# EAGLE design combined-board (EAGLE 7.2.0)
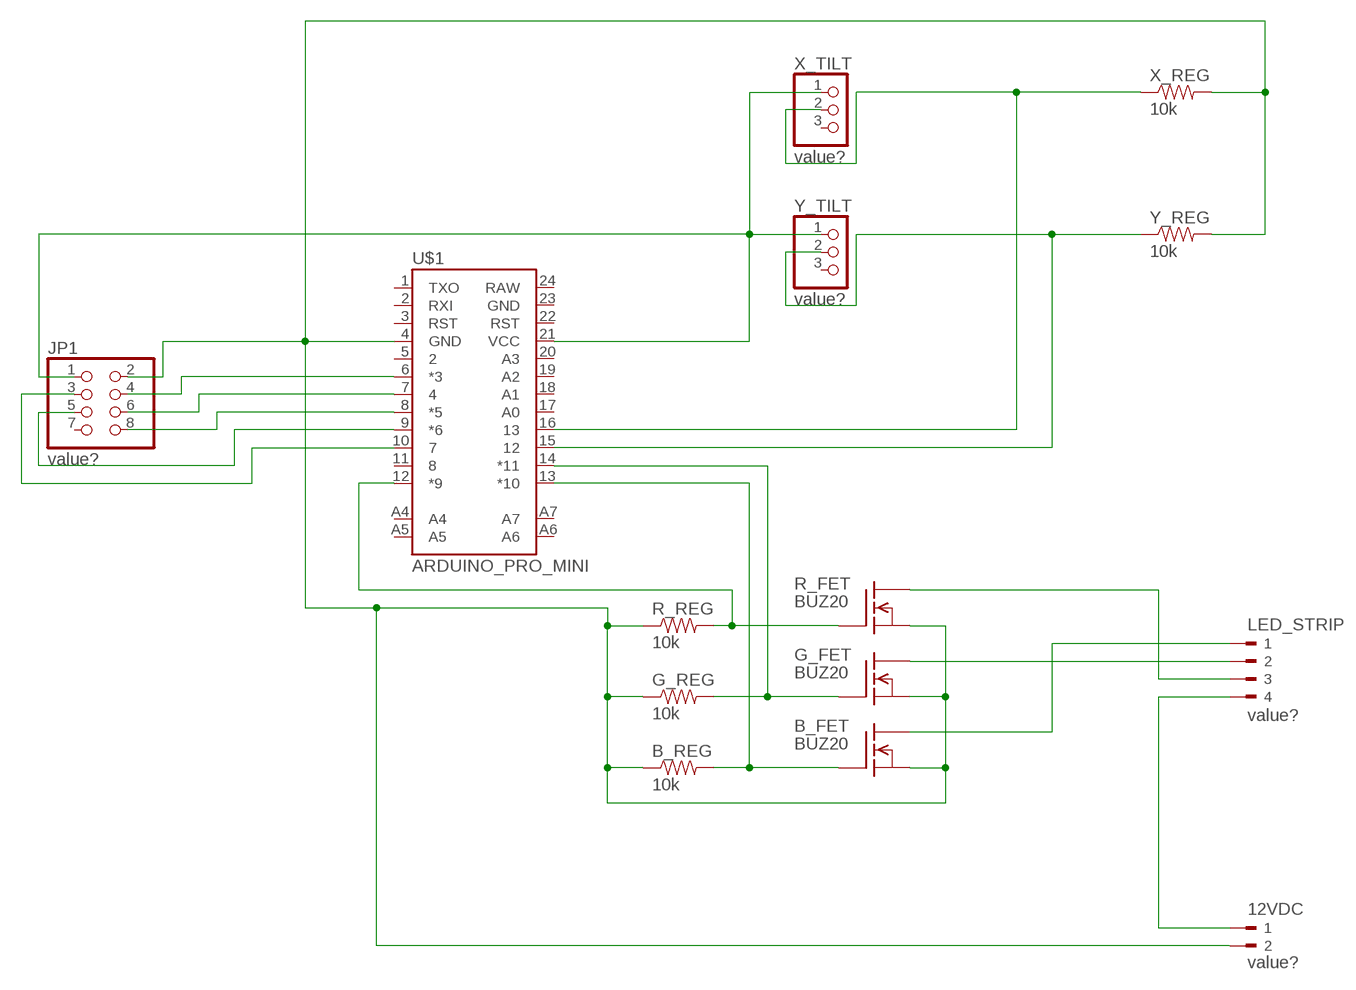
[diagram p0: schematic, sheet 1]

## Parts
12VDC  value?  180-2  [180-2]
B_FET  BUZ20  [TO220]
B_REG  10k  RESISTORPTH-1/4W  [AXIAL-0.4]
G_FET  BUZ20  [TO220]
G_REG  10k  RESISTORPTH-1/4W  [AXIAL-0.4]
JP1  value?  PINHD-2X4  [2X04]
LED_STRIP  value?  180-4  [180-4]
R_FET  BUZ20  [TO220]
R_REG  10k  RESISTORPTH-1/4W  [AXIAL-0.4]
U$1  ARDUINO_PRO_MINI  [ARDUINO_PRO_MINI]
X_REG  10k  RESISTORPTH-1/4W  [AXIAL-0.4]
X_TILT  value?  PINHD-1X3  [1X03]
Y_REG  10k  RESISTORPTH-1/4W  [AXIAL-0.4]
Y_TILT  value?  PINHD-1X3  [1X03]

## Nets
N$1: U$1.16 X_REG.P$1 X_TILT.2
N$2: B_FET.1(G) B_REG.P$2 U$1.13(*10)
N$3: R_FET.1(G) R_REG.P$2 U$1.12(*9)
N$5: B_FET.2(D) LED_STRIP.1
N$6: U$1.15 Y_REG.P$1 Y_TILT.2
N$7: LED_STRIP.3 R_FET.2(D)
N$8: G_FET.2(D) LED_STRIP.2
N$9: 12VDC.1 LED_STRIP.4
N$10: 12VDC.2 B_FET.3(S) B_REG.P$1 G_FET.3(S) G_REG.P$1 JP1.2 R_FET.3(S) R_REG.P$1 U$1.4(GND) X_REG.P$2 Y_REG.P$2
N$12: JP1.5 U$1.9(*6)
N$13: G_FET.1(G) G_REG.P$2 U$1.14(*11)
N$14: JP1.4 U$1.6(*3)
N$15: JP1.6 U$1.7
N$16: JP1.8 U$1.8(*5)
N$17: JP1.3 U$1.10
Y_TILT: JP1.1 U$1.21(VCC) X_TILT.1 Y_TILT.1
Unconnected: JP1.7 U$1.1(TXO) U$1.2(RXI) U$1.3(RST) U$1.5 U$1.11 U$1.17(A0) U$1.18(A1) U$1.19(A2) U$1.20(A3) U$1.22(RST) U$1.23(GND) U$1.24(RAW) U$1.A4 U$1.A5 U$1.A6 U$1.A7 X_TILT.3 Y_TILT.3

## Library data of the parts
12VDC = con-weidmueller-sl35:180-2: WEIDMUELLER CLAMP CONNECTOR; OC_FARNELL: unknown; OC_NEWARK: unknown
B_FET G_FET R_FET = transistor-fet:BUZ20: N-Channel Enhancement MOSFET 100V; 12A; 0,2Ohm
B_REG G_REG R_REG X_REG Y_REG = SparkFun-Passives:RESISTOR: Resistor Basic schematic elements and footprints for 0603, 1206, and PTH resistors.
JP1 = pinhead:PINHD-2X4: PIN HEADER
LED_STRIP = con-weidmueller-sl35:180-4: WEIDMUELLER CLAMP CONNECTOR; OC_FARNELL: unknown; OC_NEWARK: unknown
U$1 = SparkFun-Boards:ARDUINO_PRO_MINI
X_TILT Y_TILT = pinhead:PINHD-1X3: PIN HEADER

## Board
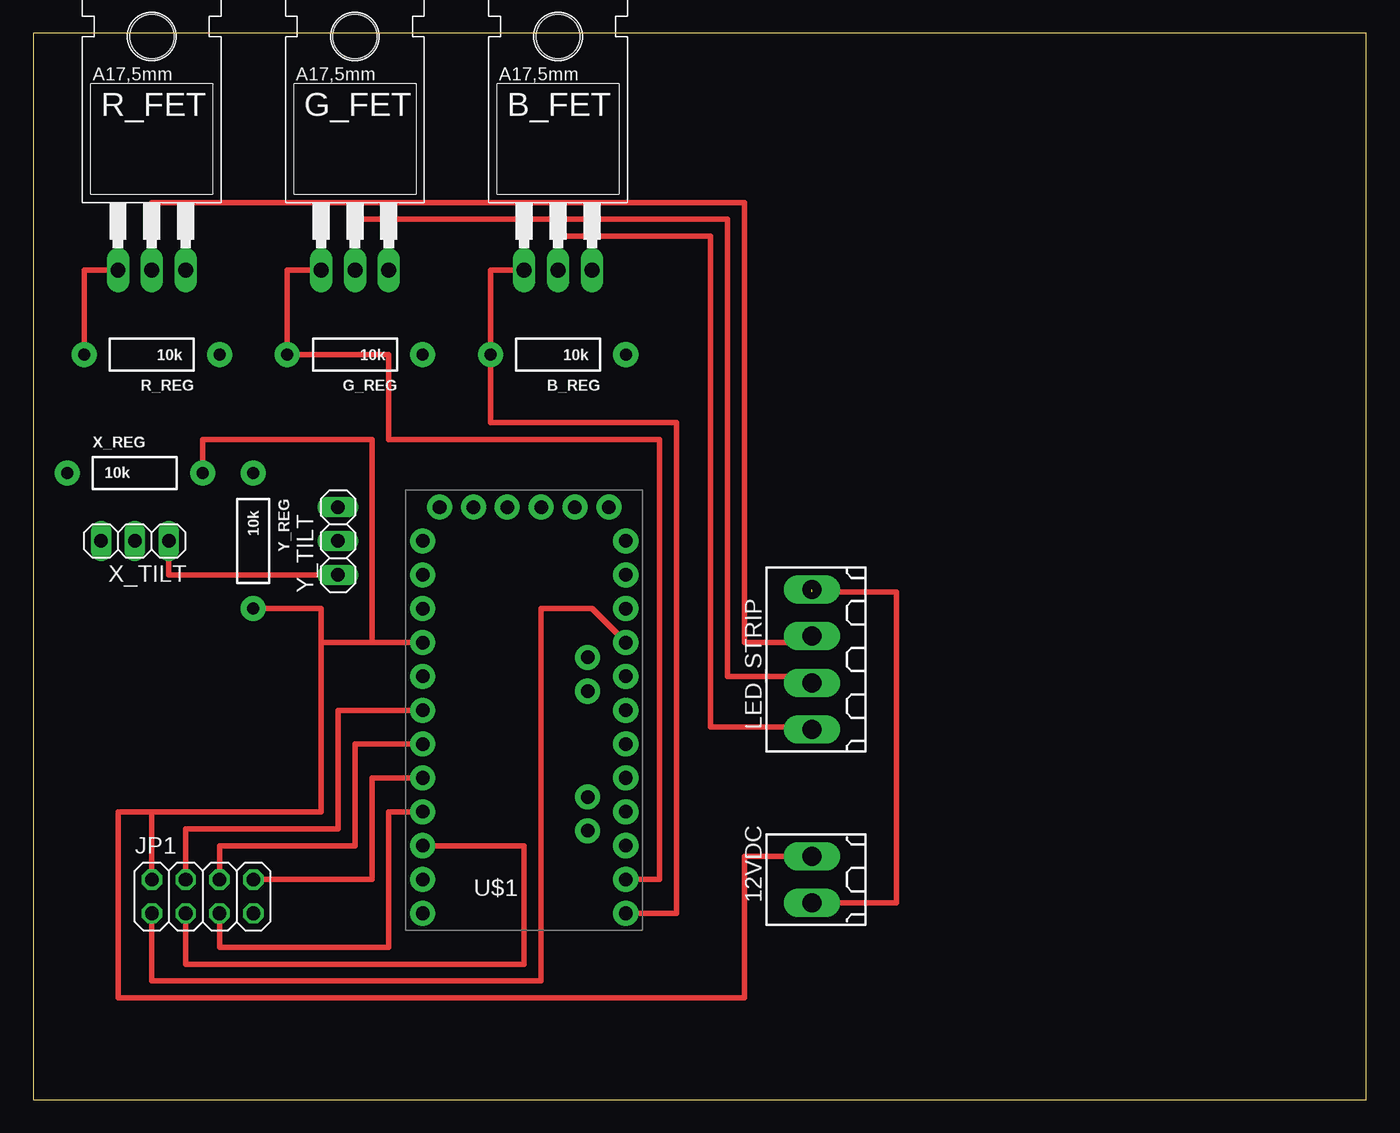
[diagram p1: board, top side]
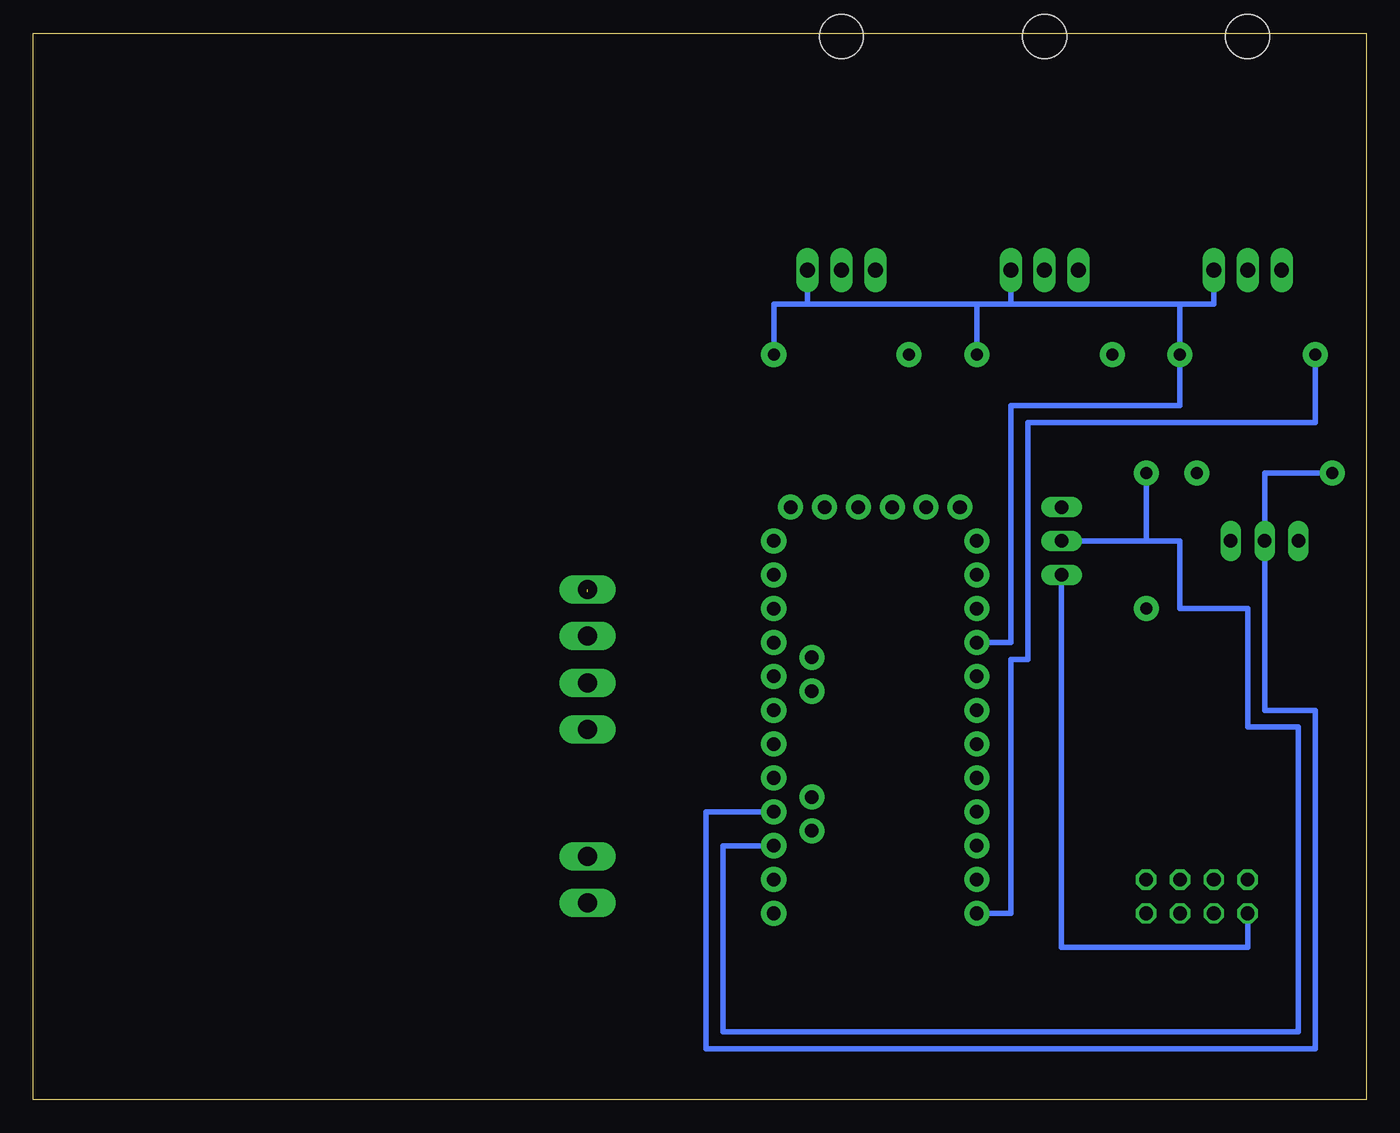
[diagram p2: board, bottom side, seen from below]

Size 100 x 80 mm. Coordinates in mm from the lower left corner, seen from the top.
Outline: 0,0 100,0 100,80 0,80 0,0
Copper layers (1*16): Top 0.035mm / dielectric 1.5mm / Bottom 0.035mm
Design rules "default": minimum track width 10mil, minimum drill 24mil, track to track 8mil, track to pad 8mil, pad to pad 8mil, via to via 8mil, smd to smd 8mil, copper to edge 40mil, drill to drill 8mil, minimum pad ring 10mil, minimum via ring 8mil, stop-mask expansion 4mil, vias tented up to drill 0mil, thermal gap 10mil

### Footprints (pad centres in the part's own frame; a part is rotated, then mirrored left to right if it is on the bottom)
180-2 = drill 1.422 long: 1 -1.75,0; 2 1.75,0
TO220 = drill 1.118 long: 1 -2.54,-6.35; 2 0,-6.35; 3 2.54,-6.35 | hole 3.302: 0,11.176
AXIAL-0.4 = drill 0.9 pad 1.88: P$1 -5.08,0; P$2 5.08,0
2X04 = drill 1.016 octagon: 1 -3.81,-1.27; 2 -3.81,1.27; 3 -1.27,-1.27; 4 -1.27,1.27; 5 1.27,-1.27; 6 1.27,1.27; 7 3.81,-1.27; 8 3.81,1.27
180-4 = drill 1.422 long: 1 -5.25,0; 2 -1.75,0; 3 1.75,0; 4 5.25,0
ARDUINO_PRO_MINI = drill 1.016 pad 1.88: 1 -7.62,12.7; 2 -7.62,10.16; 3 -7.62,7.62; 4 -7.62,5.08; 5 -7.62,2.54; 6 -7.62,0; 7 -7.62,-2.54; 8 -7.62,-5.08; 9 -7.62,-7.62; 10 -7.62,-10.16; 11 -7.62,-12.7; 12 -7.62,-15.24; 13 7.62,-15.24; 14 7.62,-12.7; 15 7.62,-10.16; 16 7.62,-7.62; 17 7.62,-5.08; 18 7.62,-2.54; 19 7.62,0; 20 7.62,2.54; 21 7.62,5.08; 22 7.62,7.62; 23 7.62,10.16; 24 7.62,12.7; A4 4.763,1.429; A5 4.763,3.969; A6 4.763,-9.049; A7 4.763,-6.509; BLK -6.35,15.24; GND -3.81,15.24; GRN 6.35,15.24; RXI 1.27,15.24; TXO 3.81,15.24; VCC -1.27,15.24
1X03 = drill 1.016 long: 1 -2.54,0; 2 0,0; 3 2.54,0

### Placement (x,y rotation side)
12VDC  58.42,16.51 90 top
B_FET  39.37,68.58 0 top
B_REG  39.37,55.88 180 top
G_FET  24.13,68.58 0 top
G_REG  24.13,55.88 180 top
JP1  12.7,15.24 0 top
LED_STRIP  58.42,33.02 90 top
R_FET  8.89,68.58 0 top
R_REG  8.89,55.88 180 top
U$1  36.83,29.21 0 top
X_REG  7.62,46.99 0 top
X_TILT  7.62,41.91 180 top
Y_REG  16.51,41.91 270 top
Y_TILT  22.86,41.91 90 top

### Tracks (layer width: path | path; a pad name or v marks a point on that pad's centre or on a via)
N$1
  Bottom 0.406: U$1.16 49.53,21.59 49.53,3.81 3.81,3.81 3.81,29.21 7.62,29.21 X_TILT.2 7.62,46.99 X_REG.P$1
N$2
  Top 0.406: B_FET.1 34.29,62.23 B_REG.P$2 34.29,50.8 48.26,50.8 48.26,13.97 U$1.13
N$3
  Top 0.406: R_FET.1 3.81,62.23 R_REG.P$2
  Bottom 0.406: R_REG.P$2 3.81,50.8 25.4,50.8 25.4,33.02 26.67,33.02 26.67,13.97 U$1.12
N$5
  Top 0.406: B_FET.2 39.37,64.77 50.8,64.77 50.8,27.94 58.42,27.94 LED_STRIP.1
N$6
  Bottom 0.406: U$1.15 48.26,19.05 48.26,5.08 5.08,5.08 5.08,27.94 8.89,27.94 8.89,36.83 13.97,36.83 13.97,41.91 16.51,41.91 | 16.51,41.91 Y_TILT.2 | Y_REG.P$1 16.51,41.91
N$7
  Top 0.406: R_FET.2 8.89,67.31 53.34,67.31 53.34,34.29 58.42,34.29 LED_STRIP.3
N$8
  Top 0.406: G_FET.2 24.13,66.04 52.07,66.04 52.07,31.75 58.42,31.75 LED_STRIP.2
N$9  (1 unrouted)
  Top 0.406: 12VDC.1 64.77,14.76 64.77,38.1 58.42,38.1
N$10
  Top 0.406: JP1.2 8.89,21.59 | 8.89,21.59 21.59,21.59 21.59,34.29 | 21.59,34.29 25.4,34.29 | 25.4,34.29 U$1.4 | 12VDC.2 53.34,18.26 53.34,7.62 6.35,7.62 6.35,21.59 8.89,21.59 | Y_REG.P$2 21.59,36.83 21.59,34.29 | X_REG.P$2 12.7,49.53 25.4,49.53 25.4,34.29
  Bottom 0.406: 13.97,59.69 26.67,59.69 | 26.67,59.69 29.21,59.69 | B_FET.3 41.91,59.69 | G_REG.P$1 29.21,59.69 | 29.21,59.69 41.91,59.69 | 13.97,59.69 R_REG.P$1 13.97,52.07 26.67,52.07 26.67,34.29 U$1.4 | 13.97,59.69 11.43,59.69 R_FET.3 | B_REG.P$1 44.45,59.69 41.91,59.69 | G_FET.3 26.67,59.69
N$12
  Top 0.406: U$1.9 26.67,21.59 26.67,11.43 13.97,11.43 JP1.5
N$13
  Top 0.406: G_FET.1 19.05,62.23 G_REG.P$2 26.67,55.88 26.67,49.53 46.99,49.53 46.99,16.51 U$1.14
N$14
  Top 0.406: U$1.6 22.86,29.21 22.86,20.32 11.43,20.32 JP1.4
N$15
  Top 0.406: U$1.7 24.13,26.67 24.13,19.05 13.97,19.05 JP1.6
N$16
  Top 0.406: U$1.8 25.4,24.13 25.4,16.51 JP1.8
N$17
  Top 0.406: JP1.3 11.43,10.16 36.83,10.16 36.83,19.05 U$1.10
Y_TILT
  Top 0.406: JP1.1 8.89,8.89 38.1,8.89 38.1,36.83 41.91,36.83 U$1.21 | X_TILT.1 10.16,39.37 Y_TILT.1
  Bottom 0.406: Y_TILT.1 22.86,11.43 8.89,11.43 JP1.1